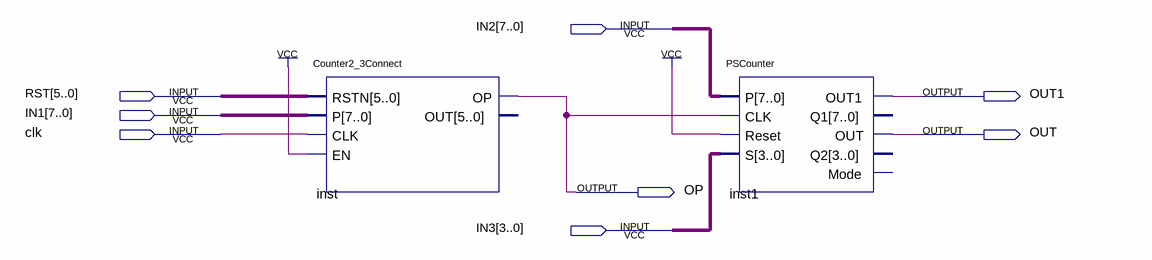
[diagram p0: schematic sheet]
// Quartus schematic AllCounter.bdf as structural Verilog: 2 symbols, 8 pins
module AllCounter (
  input  [7:0] IN2,
  input  [5:0] RST,
  input  [7:0] IN1,
  input  clk,
  input  [3:0] IN3,
  output OUT1,
  output OUT,
  output OP
);

  Counter2_3Connect inst (.RSTN(RST), .P(IN1), .CLK(clk), .EN(1'b1), .OP(OP));  // open: OUT
  PSCounter inst1 (.P(IN2), .CLK(OP), .Reset(1'b1), .S(IN3), .OUT1(OUT1), .OUT(OUT));  // open: Q1, Q2, Mode
endmodule
